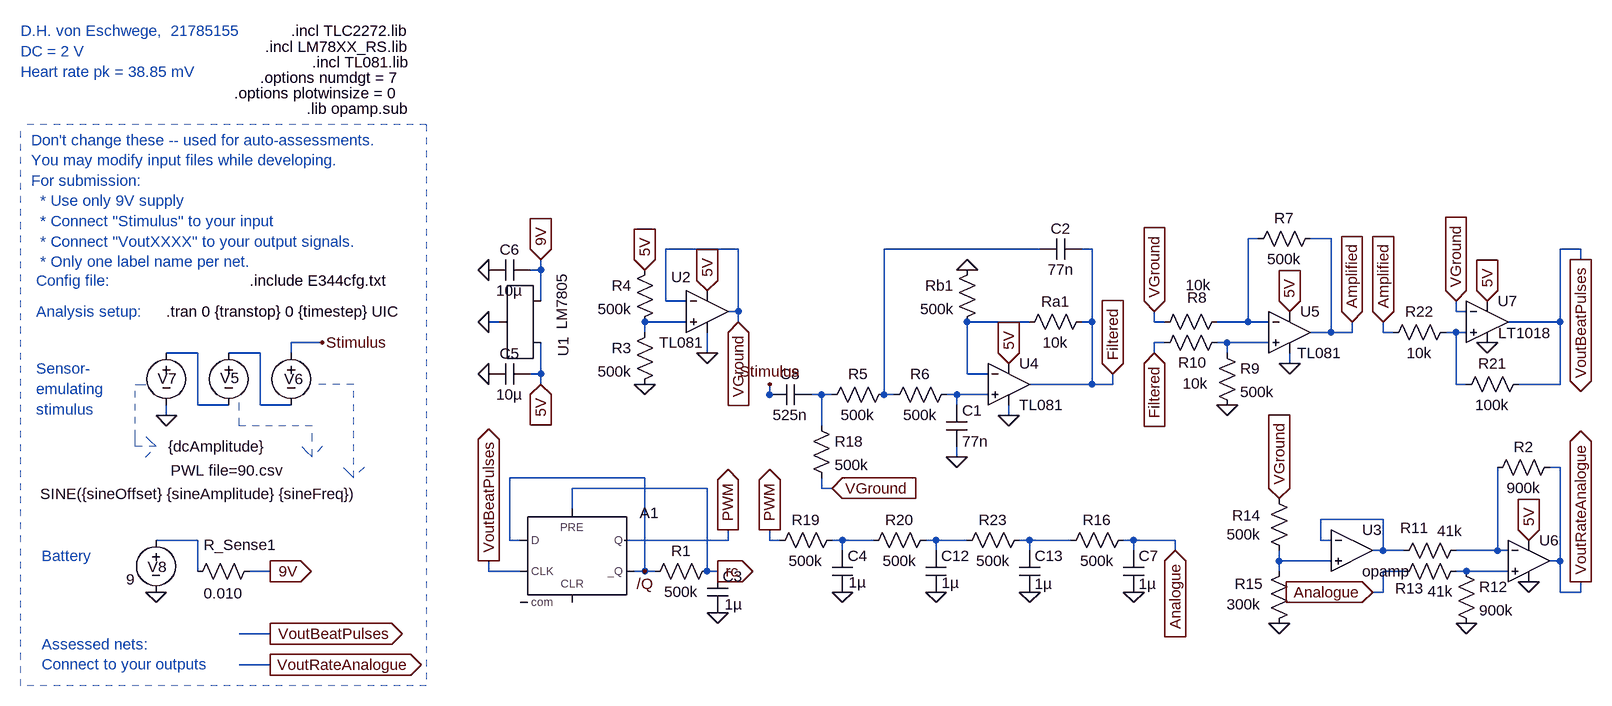
[diagram p0: schematic von_Eschwege_21785155_A2.asc]
von_Eschwege_21785155_A2.asc, the LTspice schematic file:
Version 4
SHEET 1 2292 744
WIRE -464 -1232 -480 -1232
WIRE -352 -1232 -384 -1232
WIRE -1264 -1216 -1376 -1216
WIRE -800 -1216 -1040 -1216
WIRE -720 -1216 -736 -1216
WIRE 32 -1216 0 -1216
WIRE 32 -1200 32 -1216
WIRE -1568 -1184 -1568 -1200
WIRE -1568 -1184 -1584 -1184
WIRE -1568 -1136 -1568 -1184
WIRE -1376 -1136 -1376 -1216
WIRE -1344 -1136 -1376 -1136
WIRE -1264 -1120 -1264 -1216
WIRE -1264 -1120 -1280 -1120
WIRE -160 -1120 -160 -1136
WIRE -144 -1120 -160 -1120
WIRE -1632 -1104 -1648 -1104
WIRE -1344 -1104 -1408 -1104
WIRE -1264 -1104 -1264 -1120
WIRE -816 -1104 -912 -1104
WIRE -720 -1104 -720 -1216
WIRE -720 -1104 -736 -1104
WIRE -624 -1104 -624 -1120
WIRE -608 -1104 -624 -1104
WIRE -480 -1104 -480 -1232
WIRE -480 -1104 -528 -1104
WIRE -448 -1104 -480 -1104
WIRE 0 -1104 0 -1216
WIRE 0 -1104 -80 -1104
WIRE -1408 -1088 -1408 -1104
WIRE -352 -1088 -352 -1232
WIRE -352 -1088 -384 -1088
WIRE -320 -1088 -320 -1104
WIRE -320 -1088 -352 -1088
WIRE -272 -1088 -272 -1104
WIRE -256 -1088 -272 -1088
WIRE -160 -1088 -176 -1088
WIRE -144 -1088 -160 -1088
WIRE -1904 -1072 -1952 -1072
WIRE -608 -1072 -624 -1072
WIRE -512 -1072 -528 -1072
WIRE -448 -1072 -512 -1072
WIRE -2096 -1056 -2144 -1056
WIRE -2000 -1056 -2048 -1056
WIRE -1952 -1056 -1952 -1072
WIRE -1312 -1056 -1312 -1088
WIRE -624 -1056 -624 -1072
WIRE -512 -1056 -512 -1072
WIRE -416 -1040 -416 -1056
WIRE -1568 -1024 -1568 -1072
WIRE -1568 -1024 -1584 -1024
WIRE -912 -1024 -912 -1104
WIRE -880 -1024 -912 -1024
WIRE -1568 -1008 -1568 -1024
WIRE -720 -1008 -720 -1104
WIRE -720 -1008 -816 -1008
WIRE -688 -1008 -688 -1024
WIRE -688 -1008 -720 -1008
WIRE -160 -1008 -160 -1088
WIRE -144 -1008 -160 -1008
WIRE 0 -1008 0 -1104
WIRE 0 -1008 -64 -1008
WIRE -1216 -992 -1216 -1008
WIRE -1200 -992 -1216 -992
WIRE -1136 -992 -1152 -992
WIRE -1120 -992 -1136 -992
WIRE -1040 -992 -1040 -1216
WIRE -1024 -992 -1040 -992
WIRE -928 -992 -944 -992
WIRE -880 -992 -928 -992
WIRE -2096 -976 -2096 -1056
WIRE -2048 -976 -2096 -976
WIRE -2000 -976 -2000 -1056
WIRE -1952 -976 -2000 -976
WIRE -928 -976 -928 -992
WIRE -2144 -960 -2144 -976
WIRE -848 -960 -848 -976
WIRE -1136 -944 -1136 -992
WIRE -928 -896 -928 -912
WIRE 0 -880 -16 -880
WIRE -1408 -864 -1616 -864
WIRE -1312 -848 -1520 -848
WIRE -1136 -848 -1136 -864
WIRE -1120 -848 -1136 -848
WIRE -1520 -816 -1520 -848
WIRE -272 -800 -368 -800
WIRE -2096 -768 -2160 -768
WIRE -1616 -768 -1616 -864
WIRE -1600 -768 -1616 -768
WIRE -1280 -768 -1280 -784
WIRE -1280 -768 -1440 -768
WIRE -1216 -768 -1216 -784
WIRE -1200 -768 -1216 -768
WIRE -1104 -768 -1120 -768
WIRE -1056 -768 -1104 -768
WIRE -960 -768 -976 -768
WIRE -912 -768 -960 -768
WIRE -816 -768 -832 -768
WIRE -752 -768 -816 -768
WIRE -656 -768 -672 -768
WIRE -592 -768 -656 -768
WIRE -368 -768 -368 -800
WIRE -352 -768 -368 -768
WIRE -1104 -752 -1104 -768
WIRE -960 -752 -960 -768
WIRE -816 -752 -816 -768
WIRE -656 -752 -656 -768
WIRE -592 -752 -592 -768
WIRE -272 -752 -272 -800
WIRE -272 -752 -288 -752
WIRE -240 -752 -272 -752
WIRE -96 -752 -96 -880
WIRE -96 -752 -160 -752
WIRE -80 -752 -96 -752
WIRE -432 -736 -432 -752
WIRE -352 -736 -432 -736
WIRE 0 -736 0 -880
WIRE 0 -736 -16 -736
WIRE -2096 -720 -2096 -768
WIRE -1984 -720 -2016 -720
WIRE -1648 -720 -1648 -736
WIRE -1600 -720 -1648 -720
WIRE -1408 -720 -1408 -864
WIRE -1408 -720 -1424 -720
WIRE -1392 -720 -1408 -720
WIRE -1312 -720 -1312 -848
WIRE -1296 -720 -1312 -720
WIRE -432 -720 -432 -736
WIRE -240 -720 -272 -720
WIRE -144 -720 -160 -720
WIRE -80 -720 -144 -720
WIRE -272 -688 -272 -720
WIRE -272 -688 -288 -688
WIRE 0 -688 0 -736
WIRE 32 -688 32 -704
WIRE 32 -688 0 -688
WIRE -1984 -624 -2032 -624
WIRE -1984 -576 -2032 -576
FLAG -1648 -1104 0
FLAG -1568 -1200 9V
IOPIN -1568 -1200 In
FLAG -1648 -1184 0
FLAG -1648 -1024 0
FLAG -1568 -1008 5V
IOPIN -1568 -1008 In
FLAG -1408 -1008 0
FLAG -1408 -1184 5V
IOPIN -1408 -1184 In
FLAG -1312 -1056 0
FLAG -1312 -1152 5V
IOPIN -1312 -1152 In
FLAG -1264 -1104 VGround
IOPIN -1264 -1104 In
FLAG -848 -960 0
FLAG -928 -896 0
FLAG -912 -1184 0
FLAG -848 -1040 5V
IOPIN -848 -1040 In
FLAG -416 -1040 0
FLAG -512 -976 0
FLAG -416 -1120 5V
IOPIN -416 -1120 In
FLAG -112 -1136 5V
IOPIN -112 -1136 In
FLAG -112 -1072 0
FLAG -1216 -1008 Stimulus
FLAG -1120 -848 VGround
IOPIN -1120 -848 In
FLAG 32 -1200 VoutBeatPulses
IOPIN 32 -1200 Out
FLAG -1408 -720 /Q
FLAG -1296 -656 0
FLAG -1648 -736 VoutBeatPulses
IOPIN -1648 -736 Out
FLAG -688 -1024 Filtered
IOPIN -688 -1024 In
FLAG -624 -1056 Filtered
IOPIN -624 -1056 In
FLAG -320 -1104 Amplified
IOPIN -320 -1104 In
FLAG -272 -1104 Amplified
IOPIN -272 -1104 In
FLAG -624 -1120 VGround
IOPIN -624 -1120 In
FLAG -160 -1136 VGround
IOPIN -160 -1136 In
FLAG -1280 -784 PWM
IOPIN -1280 -784 Out
FLAG -1104 -688 0
FLAG -960 -688 0
FLAG -816 -688 0
FLAG -592 -752 Analogue
IOPIN -592 -752 In
FLAG -1216 -784 PWM
IOPIN -1216 -784 Out
FLAG -144 -640 0
FLAG -288 -688 Analogue
IOPIN -288 -688 In
FLAG -432 -640 0
FLAG -48 -768 5V
IOPIN -48 -768 In
FLAG -48 -704 0
FLAG -432 -832 VGround
IOPIN -432 -832 In
FLAG -656 -688 0
FLAG 32 -704 VoutRateAnalogue
IOPIN 32 -704 Out
FLAG -2144 -960 0
FLAG -1904 -1072 Stimulus
FLAG -1984 -720 9V
IOPIN -1984 -720 Out
FLAG -2160 -688 0
FLAG -1984 -624 VoutBeatPulses
IOPIN -1984 -624 Out
FLAG -1984 -576 VoutRateAnalogue
IOPIN -1984 -576 Out
FLAG -1296 -720 rc
IOPIN -1296 -720 Out
SYMBOL LM7805 -1584 -1104 R90
WINDOW 0 39 -35 Bottom 2
WINDOW 3 -32 -64 Top 2
SYMATTR InstName U1
SYMBOL cap -1584 -1040 R90
WINDOW 0 0 32 VBottom 2
WINDOW 3 32 32 VTop 2
SYMATTR InstName C5
SYMATTR Value 10µ
SYMBOL cap -1584 -1168 M270
WINDOW 0 32 32 VTop 2
WINDOW 3 0 32 VBottom 2
SYMATTR InstName C6
SYMATTR Value 10µ
SYMBOL res -1392 -1104 M0
SYMATTR InstName R3
SYMATTR Value 500k
SYMBOL res -1392 -1200 M0
SYMATTR InstName R4
SYMATTR Value 500k
SYMBOL Opamps\\opamp2 -1312 -1184 R0
WINDOW 0 -55 11 Left 2
WINDOW 3 -74 112 Left 2
SYMATTR InstName U2
SYMATTR Value TL081
SYMBOL res -1024 -1008 R90
WINDOW 0 0 56 VBottom 2
WINDOW 3 32 56 VTop 2
SYMATTR InstName R5
SYMATTR Value 500k
SYMBOL cap -944 -976 R0
SYMATTR InstName C1
SYMATTR Value 77n
SYMBOL Opamps\\opamp2 -848 -1072 R0
SYMATTR InstName U4
SYMATTR Value TL081
SYMBOL res -928 -1008 R90
WINDOW 0 0 56 VBottom 2
WINDOW 3 32 56 VTop 2
SYMATTR InstName R6
SYMATTR Value 500k
SYMBOL res -720 -1120 R90
WINDOW 0 0 56 VBottom 2
WINDOW 3 32 56 VTop 2
SYMATTR InstName Ra1
SYMATTR Value 10k
SYMBOL res -896 -1200 M0
SYMATTR InstName Rb1
SYMATTR Value 500k
SYMBOL cap -736 -1232 R90
WINDOW 0 0 32 VBottom 2
WINDOW 3 32 32 VTop 2
SYMATTR InstName C2
SYMATTR Value 77n
SYMBOL res -368 -1248 R90
WINDOW 0 0 56 VBottom 2
WINDOW 3 32 56 VTop 2
SYMATTR InstName R7
SYMATTR Value 500k
SYMBOL res -512 -1120 R90
WINDOW 0 -6 46 VBottom 2
WINDOW 3 -56 44 VTop 2
SYMATTR InstName R8
SYMATTR Value 10k
SYMBOL Opamps\\opamp2 -416 -1152 R0
WINDOW 3 12 96 Left 2
SYMATTR Value TL081
SYMATTR InstName U5
SYMBOL res -528 -1072 R0
SYMATTR InstName R9
SYMATTR Value 500k
SYMBOL res -512 -1088 R90
WINDOW 0 62 53 VBottom 2
WINDOW 3 63 49 VTop 2
SYMATTR InstName R10
SYMATTR Value 10k
SYMBOL Comparators\\LT1018 -112 -1104 R0
WINDOW 3 17 17 Left 2
SYMATTR InstName U7
SYMBOL cap -1152 -976 M270
WINDOW 0 32 32 VTop 2
WINDOW 3 0 32 VBottom 2
SYMATTR InstName C8
SYMATTR Value 525n
SYMBOL res -1152 -960 R0
SYMATTR InstName R18
SYMATTR Value 500k
SYMBOL res -48 -1024 R90
WINDOW 0 0 56 VBottom 2
WINDOW 3 32 56 VTop 2
SYMATTR InstName R21
SYMATTR Value 100k
SYMBOL res -160 -1104 R90
WINDOW 0 0 56 VBottom 2
WINDOW 3 32 56 VTop 2
SYMATTR InstName R22
SYMATTR Value 10k
SYMBOL Digital\\dflop -1520 -816 R0
SYMATTR InstName A1
SYMATTR SpiceLine Vhigh 5 Trise 10n
SYMBOL res -1296 -736 R90
WINDOW 0 0 56 VBottom 2
WINDOW 3 32 56 VTop 2
SYMATTR InstName R1
SYMATTR Value 500k
SYMBOL cap -1312 -720 R0
WINDOW 3 27 51 Left 2
SYMATTR Value 1µ
SYMATTR InstName C3
SYMBOL res -1104 -784 R90
WINDOW 0 0 56 VBottom 2
WINDOW 3 32 56 VTop 2
SYMATTR InstName R19
SYMATTR Value 500k
SYMBOL cap -1120 -752 R0
WINDOW 3 26 49 Left 2
SYMATTR Value 1µ
SYMATTR InstName C4
SYMBOL res -960 -784 R90
WINDOW 0 0 56 VBottom 2
WINDOW 3 32 56 VTop 2
SYMATTR InstName R20
SYMATTR Value 500k
SYMBOL cap -976 -752 R0
WINDOW 3 25 50 Left 2
SYMATTR Value 1µ
SYMATTR InstName C12
SYMBOL res -816 -784 R90
WINDOW 0 0 56 VBottom 2
WINDOW 3 32 56 VTop 2
SYMATTR InstName R23
SYMATTR Value 500k
SYMBOL cap -832 -752 R0
WINDOW 3 24 51 Left 2
SYMATTR Value 1µ
SYMATTR InstName C13
SYMBOL res 0 -896 R90
WINDOW 0 0 56 VBottom 2
WINDOW 3 32 56 VTop 2
SYMATTR InstName R2
SYMATTR Value 900k
SYMBOL res -144 -768 R90
WINDOW 0 -3 80 VBottom 2
WINDOW 3 -30 25 VTop 2
SYMATTR InstName R11
SYMATTR Value 41k
SYMBOL res -160 -736 R0
SYMATTR InstName R12
SYMATTR Value 900k
SYMBOL res -144 -736 R90
WINDOW 0 58 87 VBottom 2
WINDOW 3 31 40 VTop 2
SYMATTR InstName R13
SYMATTR Value 41k
SYMBOL res -448 -848 R0
WINDOW 0 -56 42 Left 2
WINDOW 3 -65 71 Left 2
SYMATTR InstName R14
SYMATTR Value 500k
SYMATTR SpiceLine tol=60k
SYMBOL res -416 -736 M0
WINDOW 0 40 35 Left 2
WINDOW 3 44 67 Left 2
SYMATTR InstName R15
SYMATTR Value 300k
SYMBOL OpAmps\\opamp -320 -816 R0
SYMATTR InstName U3
SYMBOL OpAmps\\UniversalOpamp2 -48 -736 R0
SYMATTR InstName U6
SYMBOL res -656 -784 R90
WINDOW 0 0 56 VBottom 2
WINDOW 3 32 56 VTop 2
SYMATTR InstName R16
SYMATTR Value 500k
SYMBOL cap -672 -752 R0
WINDOW 3 24 51 Left 2
SYMATTR Value 1µ
SYMATTR InstName C7
SYMBOL voltage -2048 -1072 R0
WINDOW 123 0 0 Left 0
WINDOW 39 0 0 Left 0
WINDOW 3 -89 197 Left 2
WINDOW 0 -13 54 Left 2
SYMATTR Value PWL file=90.csv
SYMATTR InstName V5
SYMBOL voltage -1952 -1072 R0
WINDOW 123 24 44 Left 2
WINDOW 39 0 0 Left 0
WINDOW 3 -386 233 Left 2
WINDOW 0 -11 56 Left 2
SYMATTR Value SINE({sineOffset} {sineAmplitude} {sineFreq})
SYMATTR InstName V6
SYMBOL voltage -2144 -1072 R0
WINDOW 123 0 0 Left 0
WINDOW 39 0 0 Left 0
WINDOW 3 3 160 Left 2
WINDOW 0 -13 55 Left 2
SYMATTR Value {dcAmplitude}
SYMATTR InstName V7
SYMBOL voltage -2160 -784 R0
WINDOW 123 24 44 Left 2
WINDOW 39 0 0 Left 0
WINDOW 3 -46 76 Left 2
WINDOW 0 -13 57 Left 2
SYMATTR Value 9
SYMATTR InstName V8
SYMBOL res -2000 -736 R90
WINDOW 0 -9 30 VBottom 2
WINDOW 3 34 56 VTop 2
SYMATTR InstName R_Sense1
SYMATTR Value 0.010
TEXT -2368 -1552 Left 2 ;D.H. von Eschwege,  21785155\nDC = 2 V\nHeart rate pk = 38.85 mV
TEXT -1952 -1552 Left 2 !.incl TLC2272.lib
TEXT -1992 -1528 Left 2 !.incl LM78XX_RS.lib
TEXT -1920 -1504 Left 2 !.incl TL081.lib
TEXT -2000 -1480 Left 2 !.options numdgt = 7
TEXT -2040 -1456 Left 2 !.options plotwinsize = 0
TEXT -1928 -1432 Left 2 !.lib opamp.sub
TEXT -2144 -1120 Left 2 !.tran 0 {transtop} 0 {timestep} UIC
TEXT -2016 -1168 Left 2 !.include E344cfg.txt
TEXT -2352 -1384 Left 2 ;Don't change these -- used for auto-assessments.\nYou may modify input files while developing.\nFor submission: \n  * Use only 9V supply \n  * Connect "Stimulus" to your input\n  * Connect "VoutXXXX" to your output signals.\n  * Only one label name per net.
TEXT -2344 -1168 Left 2 ;Config file:
TEXT -2344 -1120 Left 2 ;Analysis setup:
TEXT -2336 -744 Left 2 ;Battery
TEXT -2344 -1032 Left 2 ;Sensor-\nemulating \nstimulus
TEXT -2336 -608 Left 2 ;Assessed nets:\nConnect to your outputs
LINE Normal -1856 -1008 -1920 -1008 2
LINE Normal -1856 -864 -1856 -1008 2
LINE Normal -1872 -880 -1856 -864 2
LINE Normal -1856 -864 -1872 -880 2
LINE Normal -1840 -880 -1856 -864 2
LINE Normal -2192 -1008 -2176 -1008 2
LINE Normal -2192 -928 -2192 -1008 2
LINE Normal -2192 -912 -2192 -928 2
LINE Normal -2160 -912 -2192 -912 2
LINE Normal -2176 -928 -2160 -912 2
LINE Normal -2160 -912 -2176 -928 2
LINE Normal -2176 -896 -2160 -912 2
LINE Normal -2032 -944 -2032 -992 2
LINE Normal -1920 -944 -2032 -944 2
LINE Normal -1920 -896 -1920 -944 2
LINE Normal -1936 -912 -1920 -896 2
LINE Normal -1920 -896 -1936 -912 2
LINE Normal -1904 -912 -1920 -896 2
LINE Normal -2368 -544 -2368 -1408 1
LINE Normal -1744 -1408 -1744 -544 1
LINE Normal -1744 -544 -2368 -544 1
LINE Normal -1744 -1408 -2368 -1408 1

The netlist it stands for:
* von_Eschwege_21785155_A2.asc
XU1 9V 0 5V LM7805
C5 5V 0 10µ
C6 9V 0 10µ
R3 N003 0 500k
R4 5V N003 500k
XU2 N003 VGround 5V 0 VGround TL081  ; pins In+ In- V+ V- OUT
R5 N002 N009 500k
C1 N010 0 77n
XU4 N010 N004 5V 0 Filtered TL081  ; pins In+ In- V+ V- OUT
R6 N010 N002 500k
Ra1 Filtered N004 10k
Rb1 0 N004 500k
C2 Filtered N002 77n
R7 Amplified N001 500k
R8 N001 VGround 10k
XU5 N006 N001 5V 0 Amplified TL081  ; pins In+ In- V+ V- OUT
R9 N006 0 500k
R10 N006 Filtered 10k
XU7 N005 VGround 5V 0 VoutBeatPulses LT1018  ; pins In+ In- V+ V- OUT
C8 N009 Stimulus 525n
R18 N009 VGround 500k
R21 VoutBeatPulses N005 100k
R22 N005 Amplified 10k
A1 /Q 0 VoutBeatPulses rc 0 /Q PWM 0 DFLOP Vhigh 5 Trise 10n
R1 rc /Q 500k
C3 rc 0 1µ
R19 N013 PWM 500k
C4 N013 0 1µ
R20 N014 N013 500k
C12 N014 0 1µ
R23 N015 N014 500k
C13 N015 0 1µ
R2 VoutRateAnalogue N016 900k
R11 N016 N011 41k
R12 N018 0 900k
R13 N018 Analogue 41k
R14 VGround N017 500k tol=60k
R15 N017 0 300k
XU3 N011 N017 N011 opamp Aol=100K GBW=10Meg  ; pins invin noninvin out
XU6 N018 N016 5V 0 VoutRateAnalogue level.2 Avol=1Meg GBW=10Meg Slew=10Meg ilimit=25m rail=0 Vos=0 phimargin=45 en=0 enk=0 in=0 ink=0 Rin=500Meg  ; pins IN+ IN- V+ V- OUT
R16 Analogue N015 500k
C7 Analogue 0 1µ
V5 N008 N007 PWL file=90.csv
V6 Stimulus N008 SINE({sineOffset} {sineAmplitude} {sineFreq})
V7 N007 0 {dcAmplitude}
V8 N012 0 9
R_Sense1 9V N012 0.010
* D.H. von Eschwege,  21785155
* DC = 2 V
* Heart rate pk = 38.85 mV
.incl TLC2272.lib
.incl LM78XX_RS.lib
.incl TL081.lib
.options numdgt = 7
.options plotwinsize = 0
.lib opamp.sub
.tran 0 {transtop} 0 {timestep} UIC
.include E344cfg.txt
* Don't change these -- used for auto-assessments.
* You may modify input files while developing.
* For submission:
*   * Use only 9V supply
*   * Connect "Stimulus" to your input
*   * Connect "VoutXXXX" to your output signals.
*   * Only one label name per net.
* Config file:
* Analysis setup:
* Battery
* Sensor-
* emulating
* stimulus
* Assessed nets:
* Connect to your outputs
.lib LTC1.lib
.lib UniversalOpamps2.sub
.backanno
.end